# EasyEDA schematic WhiteNoise.json
TITLE: Sheet_1; REV: 1.0; Date: 2023-06-15; Sheet: 1/1; Company: Your Company
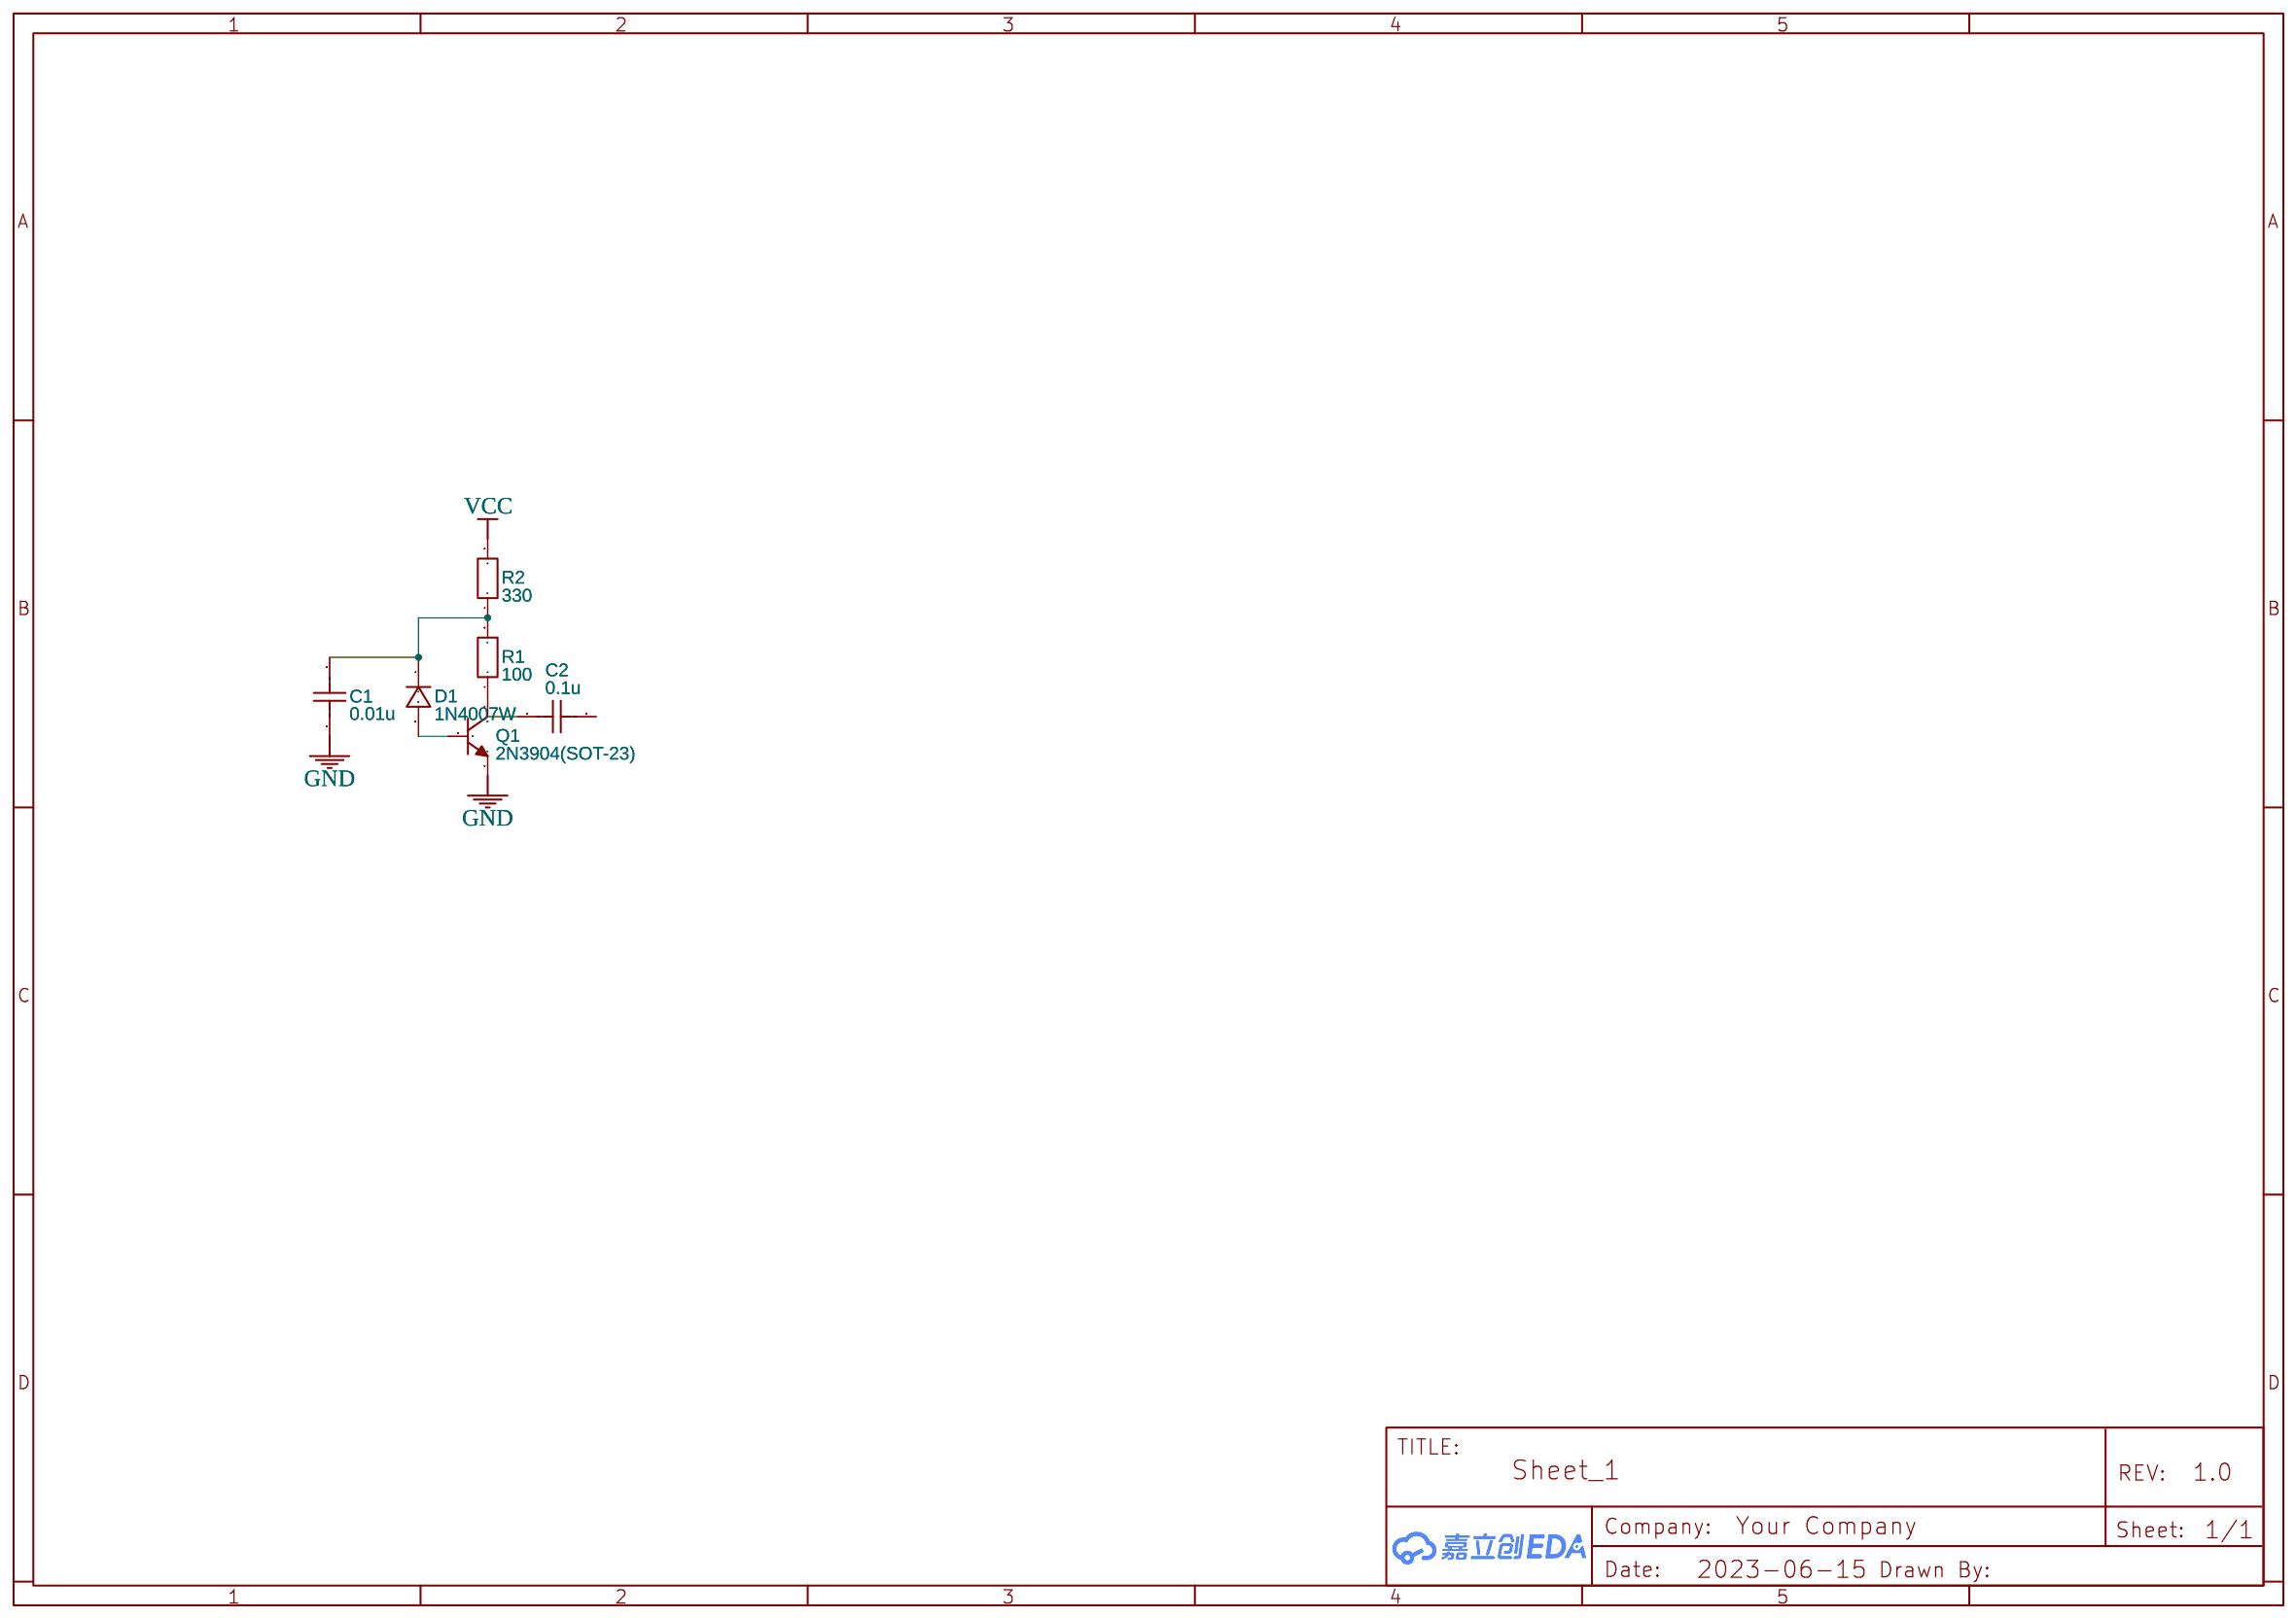
[diagram p0: schematic sheet]

## Parts
C1  0.01u  [C0603]
C2  0.1u  [C0603]
D1  1N4007W  [SOD-123_L2.8-W1.8-LS3.7-RD]
Q1  2N3904(SOT-23)  [SOT-23-3_L2.9-W1.3-P1.90-LS2.4-TR]
R1  100  [R0603]
R2  330  [R0603]

## Library data of the parts
C1 C2 = C_0603_US: Contributor: LCEDA_Lib
D1 = 1N4007W: Supplier: LCSC; Supplier Part: C328592; Manufacturer: BLUE ROCKET; Contributor: LCEDA_Lib
Q1 = 2N3904(SOT-23): Supplier: LCSC; Manufacturer: KEC; Manufacturer Part: 2n3904S-RTK/PS; Supplier Part: C18536; Paste Type: SOT-23; Contributor: LCEDA_Lib
R1 R2 = R_0603_EU: Contributor: LCEDA_Lib

## Nets
GND: C1.1 Q1.2(E)
VCC: R2.2
Net-(C1-2): C1.2 D1.1 R1.2 R2.1
Net-(D1-2): D1.2 Q1.3(B)
Net-(Q1-1): Q1.1(C) R1.1

Not connected (* = marked no-connect by the designer): C2 1 2
